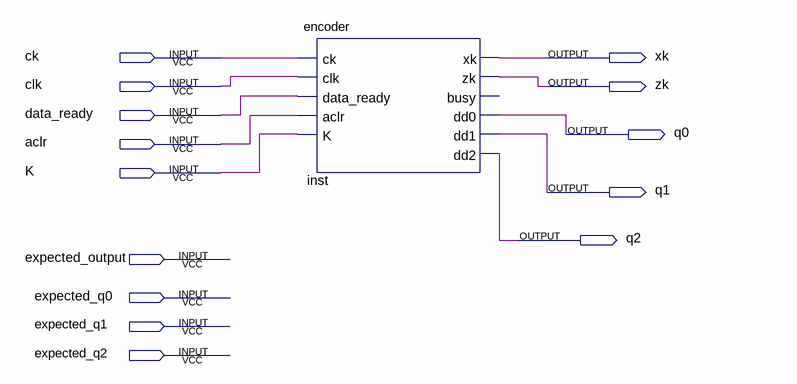
[diagram p0: schematic sheet]
// Quartus schematic encoderblock.bdf as structural Verilog: 1 symbols, 14 pins
module encoderblock (
  input  ck,
  input  clk,
  input  data_ready,
  input  aclr,
  input  K,
  input  expected_output,
  input  expected_q0,
  input  expected_q1,
  input  expected_q2,
  output xk,
  output zk,
  output q0,
  output q1,
  output q2
);

  encoder inst (
    .ck(ck), .clk(clk), .data_ready(data_ready), .aclr(aclr), .K(K), .xk(xk), .zk(zk), .dd0(q0), .dd1(q1),
    .dd2(q2));  // open: busy
endmodule
